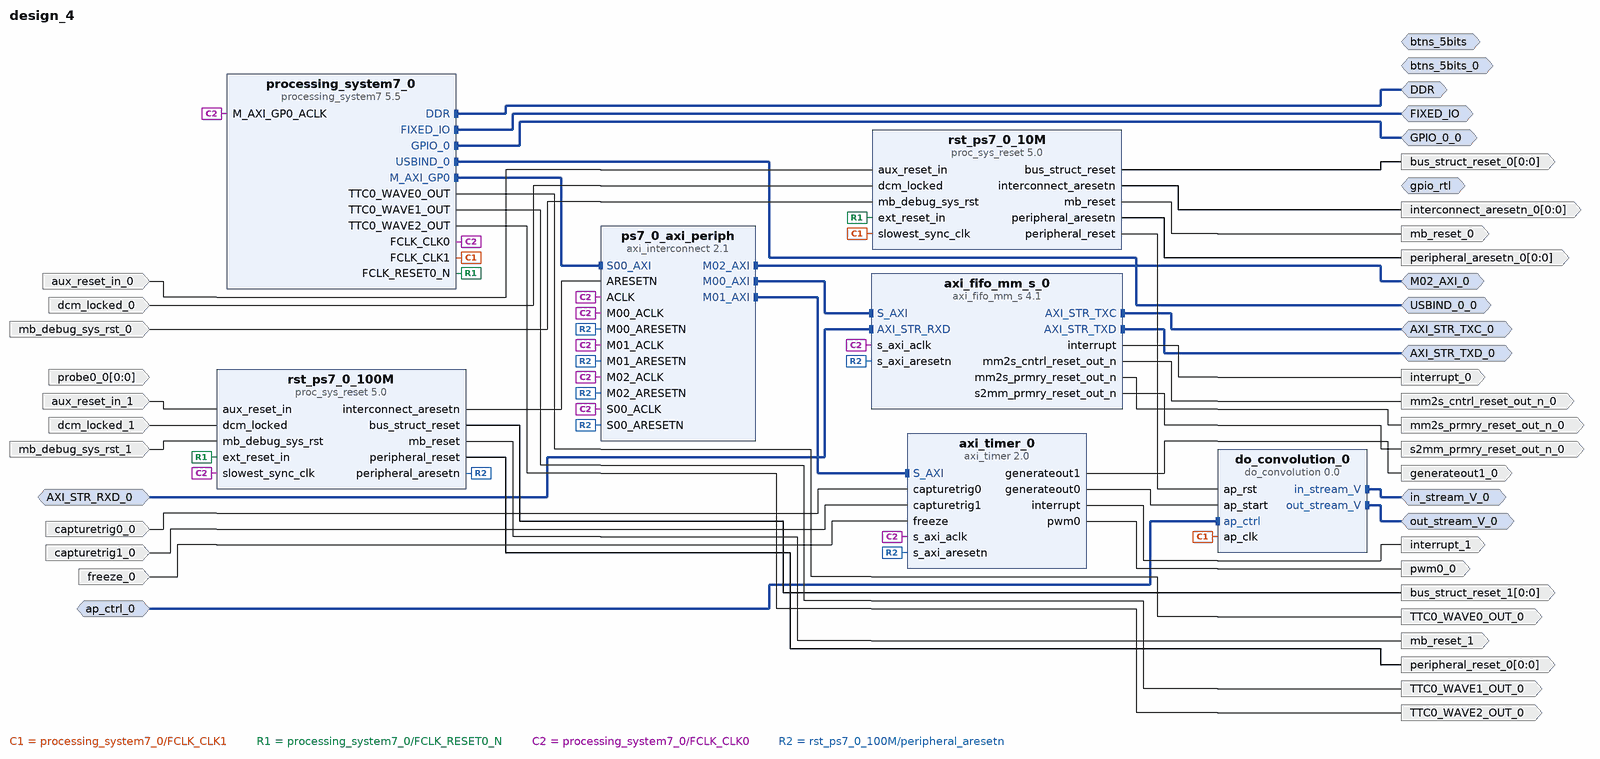
[diagram p0: block diagram of the top level]
# Vivado block design design_4, xc7z020clg484-1, Vivado 2018.1
create_bd_design design_4

create_bd_intf_port -mode Master -vlnv xilinx.com:interface:ddrx_rtl:1.0 DDR
create_bd_intf_port -mode Master -vlnv xilinx.com:display_processing_system7:fixedio_rtl:1.0 FIXED_IO
create_bd_intf_port -mode Master -vlnv xilinx.com:interface:gpio_rtl:1.0 btns_5bits
create_bd_intf_port -mode Master -vlnv xilinx.com:interface:gpio_rtl:1.0 btns_5bits_0
create_bd_intf_port -mode Master -vlnv xilinx.com:interface:gpio_rtl:1.0 gpio_rtl
create_bd_intf_port -mode Slave -vlnv xilinx.com:interface:axis_rtl:1.0 AXI_STR_RXD_0
set_property -dict [list \
  CONFIG.TDATA_NUM_BYTES 4 \
  CONFIG.TDEST_WIDTH 0 \
  CONFIG.TID_WIDTH 0 \
  CONFIG.TUSER_WIDTH 0 \
  CONFIG.HAS_TREADY 1 \
  CONFIG.HAS_TSTRB 0 \
  CONFIG.HAS_TKEEP 0 \
  CONFIG.HAS_TLAST 1 \
  CONFIG.LAYERED_METADATA undef \
] [get_bd_intf_ports AXI_STR_RXD_0]
create_bd_intf_port -mode Master -vlnv xilinx.com:interface:axis_rtl:1.0 AXI_STR_TXC_0
create_bd_intf_port -mode Master -vlnv xilinx.com:interface:axis_rtl:1.0 AXI_STR_TXD_0
create_bd_intf_port -mode Master -vlnv xilinx.com:interface:gpio_rtl:1.0 GPIO_0_0
create_bd_intf_port -mode Master -vlnv xilinx.com:display_processing_system7:usbctrl_rtl:1.0 USBIND_0_0
create_bd_intf_port -mode Slave -vlnv xilinx.com:interface:acc_handshake_rtl:1.0 ap_ctrl_0
create_bd_intf_port -mode Master -vlnv xilinx.com:interface:acc_fifo_read_rtl:1.0 in_stream_V_0
create_bd_intf_port -mode Master -vlnv xilinx.com:interface:acc_fifo_write_rtl:1.0 out_stream_V_0
create_bd_intf_port -mode Master -vlnv xilinx.com:interface:aximm_rtl:1.0 M02_AXI_0
set_property -dict [list \
  CONFIG.DATA_WIDTH 32 \
  CONFIG.PROTOCOL AXI4LITE \
  CONFIG.ADDR_WIDTH 32 \
  CONFIG.HAS_BURST 0 \
  CONFIG.HAS_LOCK 0 \
  CONFIG.HAS_CACHE 0 \
  CONFIG.HAS_QOS 0 \
  CONFIG.HAS_REGION 0 \
] [get_bd_intf_ports M02_AXI_0]
create_bd_port -dir O -type intr interrupt_0
create_bd_port -dir O -type rst mm2s_cntrl_reset_out_n_0
create_bd_port -dir O -type rst mm2s_prmry_reset_out_n_0
create_bd_port -dir O -type rst s2mm_prmry_reset_out_n_0
create_bd_port -dir I -type rst aux_reset_in_0
create_bd_port -dir O -from 0 -to 0 -type rst bus_struct_reset_0
create_bd_port -dir I dcm_locked_0
create_bd_port -dir O -from 0 -to 0 -type rst interconnect_aresetn_0
create_bd_port -dir I -type rst mb_debug_sys_rst_0
set_property -dict {CONFIG.POLARITY ACTIVE_HIGH} [get_bd_ports mb_debug_sys_rst_0]
create_bd_port -dir O -type rst mb_reset_0
create_bd_port -dir O -from 0 -to 0 -type rst peripheral_aresetn_0
create_bd_port -dir O TTC0_WAVE0_OUT_0
create_bd_port -dir O TTC0_WAVE1_OUT_0
create_bd_port -dir O TTC0_WAVE2_OUT_0
create_bd_port -dir I -from 0 -to 0 probe0_0
create_bd_port -dir I capturetrig0_0
create_bd_port -dir I capturetrig1_0
create_bd_port -dir I freeze_0
create_bd_port -dir O generateout1_0
create_bd_port -dir O -type intr interrupt_1
create_bd_port -dir O pwm0_0
create_bd_port -dir I -type rst aux_reset_in_1
create_bd_port -dir O -from 0 -to 0 -type rst bus_struct_reset_1
create_bd_port -dir I dcm_locked_1
create_bd_port -dir I -type rst mb_debug_sys_rst_1
set_property -dict {CONFIG.POLARITY ACTIVE_HIGH} [get_bd_ports mb_debug_sys_rst_1]
create_bd_port -dir O -type rst mb_reset_1
create_bd_port -dir O -from 0 -to 0 -type rst peripheral_reset_0

create_bd_cell -type ip -vlnv xilinx.com:ip:processing_system7:5.5 processing_system7_0
set_property -dict [list \
  CONFIG.PCW_FCLK_CLK1_BUF TRUE \
  CONFIG.PCW_UIPARAM_DDR_FREQ_MHZ 533.333313 \
  CONFIG.PCW_APU_PERIPHERAL_FREQMHZ 666.666667 \
  CONFIG.PCW_QSPI_PERIPHERAL_FREQMHZ 200.000000 \
  CONFIG.PCW_SDIO_PERIPHERAL_FREQMHZ 50 \
  CONFIG.PCW_UART_PERIPHERAL_FREQMHZ 50 \
  CONFIG.PCW_FPGA0_PERIPHERAL_FREQMHZ 100.000000 \
  CONFIG.PCW_FPGA1_PERIPHERAL_FREQMHZ 10.000000 \
  CONFIG.PCW_FPGA2_PERIPHERAL_FREQMHZ 50.000000 \
  CONFIG.PCW_EN_CLK1_PORT 1 \
  CONFIG.PCW_PRESET_BANK1_VOLTAGE {LVCMOS 1.8V} \
  CONFIG.PCW_UIPARAM_DDR_PARTNO {MT41J128M16 HA-15E} \
  CONFIG.PCW_QSPI_PERIPHERAL_ENABLE 1 \
  CONFIG.PCW_QSPI_QSPI_IO {MIO 1 .. 6} \
  CONFIG.PCW_QSPI_GRP_SINGLE_SS_ENABLE 1 \
  CONFIG.PCW_QSPI_GRP_SINGLE_SS_IO {MIO 1 .. 6} \
  CONFIG.PCW_SINGLE_QSPI_DATA_MODE x4 \
  CONFIG.PCW_ENET0_PERIPHERAL_ENABLE 1 \
  CONFIG.PCW_ENET0_ENET0_IO {MIO 16 .. 27} \
  CONFIG.PCW_ENET0_GRP_MDIO_ENABLE 1 \
  CONFIG.PCW_ENET0_GRP_MDIO_IO {MIO 52 .. 53} \
  CONFIG.PCW_ENET_RESET_ENABLE 0 \
  CONFIG.PCW_SD0_PERIPHERAL_ENABLE 1 \
  CONFIG.PCW_SD0_SD0_IO {MIO 40 .. 45} \
  CONFIG.PCW_SD0_GRP_CD_ENABLE 1 \
  CONFIG.PCW_SD0_GRP_CD_IO {MIO 47} \
  CONFIG.PCW_SD0_GRP_WP_ENABLE 1 \
  CONFIG.PCW_SD0_GRP_WP_IO {MIO 46} \
  CONFIG.PCW_UART1_PERIPHERAL_ENABLE 1 \
  CONFIG.PCW_UART1_UART1_IO {MIO 48 .. 49} \
  CONFIG.PCW_TTC0_PERIPHERAL_ENABLE 1 \
  CONFIG.PCW_TTC0_TTC0_IO EMIO \
  CONFIG.PCW_USB0_PERIPHERAL_ENABLE 1 \
  CONFIG.PCW_USB0_USB0_IO {MIO 28 .. 39} \
  CONFIG.PCW_USB_RESET_ENABLE 0 \
  CONFIG.PCW_I2C_RESET_ENABLE 1 \
  CONFIG.PCW_GPIO_MIO_GPIO_ENABLE 1 \
  CONFIG.PCW_GPIO_MIO_GPIO_IO MIO \
  CONFIG.PCW_GPIO_EMIO_GPIO_ENABLE 1 \
  CONFIG.PCW_GPIO_EMIO_GPIO_IO 64 \
  CONFIG.preset ZedBoard \
  CONFIG.PCW_FPGA_FCLK1_ENABLE 1 \
] [get_bd_cells processing_system7_0]
# 223 more settings of processing_system7_0 are not shown: defaults, MIO pin electricals, DDR timing, and values the tool derives
create_bd_cell -type ip -vlnv xilinx.com:hls:do_convolution:0.0 do_convolution_0
create_bd_cell -type ip -vlnv xilinx.com:ip:proc_sys_reset:5.0 rst_ps7_0_10M
create_bd_cell -type ip -vlnv xilinx.com:ip:axi_fifo_mm_s:4.1 axi_fifo_mm_s_0
create_bd_cell -type ip -vlnv xilinx.com:ip:axi_interconnect:2.1 ps7_0_axi_periph
set_property -dict {CONFIG.NUM_MI 3} [get_bd_cells ps7_0_axi_periph]
create_bd_cell -type ip -vlnv xilinx.com:ip:proc_sys_reset:5.0 rst_ps7_0_100M
create_bd_cell -type ip -vlnv xilinx.com:ip:axi_timer:2.0 axi_timer_0

# ---- connections ----

connect_bd_intf_net [get_bd_intf_pins processing_system7_0/M_AXI_GP0] [get_bd_intf_pins ps7_0_axi_periph/S00_AXI]
connect_bd_intf_net [get_bd_intf_pins ps7_0_axi_periph/M00_AXI] [get_bd_intf_pins axi_fifo_mm_s_0/S_AXI]
connect_bd_intf_net [get_bd_intf_pins ps7_0_axi_periph/M01_AXI] [get_bd_intf_pins axi_timer_0/S_AXI]
connect_bd_intf_net [get_bd_intf_ports DDR] [get_bd_intf_pins processing_system7_0/DDR]
connect_bd_intf_net [get_bd_intf_ports FIXED_IO] [get_bd_intf_pins processing_system7_0/FIXED_IO]
connect_bd_intf_net -intf_net AXI_STR_RXD_0_1 [get_bd_intf_ports AXI_STR_RXD_0] [get_bd_intf_pins axi_fifo_mm_s_0/AXI_STR_RXD]
connect_bd_intf_net [get_bd_intf_ports AXI_STR_TXC_0] [get_bd_intf_pins axi_fifo_mm_s_0/AXI_STR_TXC]
connect_bd_intf_net [get_bd_intf_ports AXI_STR_TXD_0] [get_bd_intf_pins axi_fifo_mm_s_0/AXI_STR_TXD]
connect_bd_intf_net [get_bd_intf_ports GPIO_0_0] [get_bd_intf_pins processing_system7_0/GPIO_0]
connect_bd_intf_net [get_bd_intf_ports USBIND_0_0] [get_bd_intf_pins processing_system7_0/USBIND_0]
connect_bd_intf_net -intf_net ap_ctrl_0_1 [get_bd_intf_ports ap_ctrl_0] [get_bd_intf_pins do_convolution_0/ap_ctrl]
connect_bd_intf_net [get_bd_intf_ports in_stream_V_0] [get_bd_intf_pins do_convolution_0/in_stream_V]
connect_bd_intf_net [get_bd_intf_ports out_stream_V_0] [get_bd_intf_pins do_convolution_0/out_stream_V]
connect_bd_intf_net [get_bd_intf_ports M02_AXI_0] [get_bd_intf_pins ps7_0_axi_periph/M02_AXI]
connect_bd_net [get_bd_pins processing_system7_0/FCLK_CLK1] [get_bd_pins do_convolution_0/ap_clk] [get_bd_pins rst_ps7_0_10M/slowest_sync_clk]
connect_bd_net [get_bd_pins processing_system7_0/FCLK_RESET0_N] [get_bd_pins rst_ps7_0_10M/ext_reset_in] [get_bd_pins rst_ps7_0_100M/ext_reset_in]
connect_bd_net [get_bd_pins rst_ps7_0_10M/peripheral_reset] [get_bd_pins do_convolution_0/ap_rst]
connect_bd_net [get_bd_pins processing_system7_0/FCLK_CLK0] \
  [get_bd_pins processing_system7_0/M_AXI_GP0_ACLK] [get_bd_pins ps7_0_axi_periph/S00_ACLK] \
  [get_bd_pins rst_ps7_0_100M/slowest_sync_clk] [get_bd_pins axi_fifo_mm_s_0/s_axi_aclk] \
  [get_bd_pins ps7_0_axi_periph/M00_ACLK] [get_bd_pins ps7_0_axi_periph/ACLK] [get_bd_pins ps7_0_axi_periph/M01_ACLK] \
  [get_bd_pins ps7_0_axi_periph/M02_ACLK] [get_bd_pins axi_timer_0/s_axi_aclk]
connect_bd_net [get_bd_pins rst_ps7_0_100M/peripheral_aresetn] \
  [get_bd_pins ps7_0_axi_periph/S00_ARESETN] [get_bd_pins axi_fifo_mm_s_0/s_axi_aresetn] \
  [get_bd_pins ps7_0_axi_periph/M00_ARESETN] [get_bd_pins ps7_0_axi_periph/M01_ARESETN] \
  [get_bd_pins ps7_0_axi_periph/M02_ARESETN] [get_bd_pins axi_timer_0/s_axi_aresetn]
connect_bd_net [get_bd_pins rst_ps7_0_100M/interconnect_aresetn] [get_bd_pins ps7_0_axi_periph/ARESETN]
connect_bd_net [get_bd_pins axi_timer_0/generateout0] [get_bd_pins do_convolution_0/ap_start]
connect_bd_net [get_bd_pins axi_fifo_mm_s_0/interrupt] [get_bd_ports interrupt_0]
connect_bd_net [get_bd_pins axi_fifo_mm_s_0/mm2s_cntrl_reset_out_n] [get_bd_ports mm2s_cntrl_reset_out_n_0]
connect_bd_net [get_bd_pins axi_fifo_mm_s_0/mm2s_prmry_reset_out_n] [get_bd_ports mm2s_prmry_reset_out_n_0]
connect_bd_net [get_bd_pins axi_fifo_mm_s_0/s2mm_prmry_reset_out_n] [get_bd_ports s2mm_prmry_reset_out_n_0]
connect_bd_net -net aux_reset_in_0_1 [get_bd_ports aux_reset_in_0] [get_bd_pins rst_ps7_0_10M/aux_reset_in]
connect_bd_net [get_bd_pins rst_ps7_0_10M/bus_struct_reset] [get_bd_ports bus_struct_reset_0]
connect_bd_net -net dcm_locked_0_1 [get_bd_ports dcm_locked_0] [get_bd_pins rst_ps7_0_10M/dcm_locked]
connect_bd_net [get_bd_pins rst_ps7_0_10M/interconnect_aresetn] [get_bd_ports interconnect_aresetn_0]
connect_bd_net -net mb_debug_sys_rst_0_1 [get_bd_ports mb_debug_sys_rst_0] [get_bd_pins rst_ps7_0_10M/mb_debug_sys_rst]
connect_bd_net [get_bd_pins rst_ps7_0_10M/mb_reset] [get_bd_ports mb_reset_0]
connect_bd_net [get_bd_pins rst_ps7_0_10M/peripheral_aresetn] [get_bd_ports peripheral_aresetn_0]
connect_bd_net [get_bd_pins processing_system7_0/TTC0_WAVE0_OUT] [get_bd_ports TTC0_WAVE0_OUT_0]
connect_bd_net [get_bd_pins processing_system7_0/TTC0_WAVE1_OUT] [get_bd_ports TTC0_WAVE1_OUT_0]
connect_bd_net [get_bd_pins processing_system7_0/TTC0_WAVE2_OUT] [get_bd_ports TTC0_WAVE2_OUT_0]
connect_bd_net -net capturetrig0_0_1 [get_bd_ports capturetrig0_0] [get_bd_pins axi_timer_0/capturetrig0]
connect_bd_net -net capturetrig1_0_1 [get_bd_ports capturetrig1_0] [get_bd_pins axi_timer_0/capturetrig1]
connect_bd_net -net freeze_0_1 [get_bd_ports freeze_0] [get_bd_pins axi_timer_0/freeze]
connect_bd_net [get_bd_pins axi_timer_0/generateout1] [get_bd_ports generateout1_0]
connect_bd_net [get_bd_pins axi_timer_0/interrupt] [get_bd_ports interrupt_1]
connect_bd_net [get_bd_pins axi_timer_0/pwm0] [get_bd_ports pwm0_0]
connect_bd_net -net aux_reset_in_1_1 [get_bd_ports aux_reset_in_1] [get_bd_pins rst_ps7_0_100M/aux_reset_in]
connect_bd_net [get_bd_pins rst_ps7_0_100M/bus_struct_reset] [get_bd_ports bus_struct_reset_1]
connect_bd_net -net dcm_locked_1_1 [get_bd_ports dcm_locked_1] [get_bd_pins rst_ps7_0_100M/dcm_locked]
connect_bd_net -net mb_debug_sys_rst_1_1 [get_bd_ports mb_debug_sys_rst_1] [get_bd_pins rst_ps7_0_100M/mb_debug_sys_rst]
connect_bd_net [get_bd_pins rst_ps7_0_100M/mb_reset] [get_bd_ports mb_reset_1]
connect_bd_net [get_bd_pins rst_ps7_0_100M/peripheral_reset] [get_bd_ports peripheral_reset_0]

# ---- address map ----
assign_bd_address -offset 0x42800000 -range 64K -target_address_space [get_bd_addr_spaces processing_system7_0/Data] [get_bd_addr_segs axi_timer_0/S_AXI/Reg]
assign_bd_address -offset 0x43C00000 -range 64K -target_address_space [get_bd_addr_spaces processing_system7_0/Data] [get_bd_addr_segs axi_fifo_mm_s_0/S_AXI/Mem0]

validate_bd_design
save_bd_design
